# Altium schematic sheet 05 UFS.SchDoc: CM4 IO
size 297 x 209 mm; Page Create Date: March  8, 1995; Page Number: 5; Page Size: A4; Comment: radxa_1010; Page Count: 19; RevCode: V1.10; Doc: 05 UFS; DsnPath: D:\WMS\黄工\[RC126]CM4_IO_V1.10\[RC126]_V1.10\CM4 IO_V1.10.DSN; SchematicName: CM4 IO V1.10; PageName: 05 UFS; PageSize: A4; TopSchematic: True
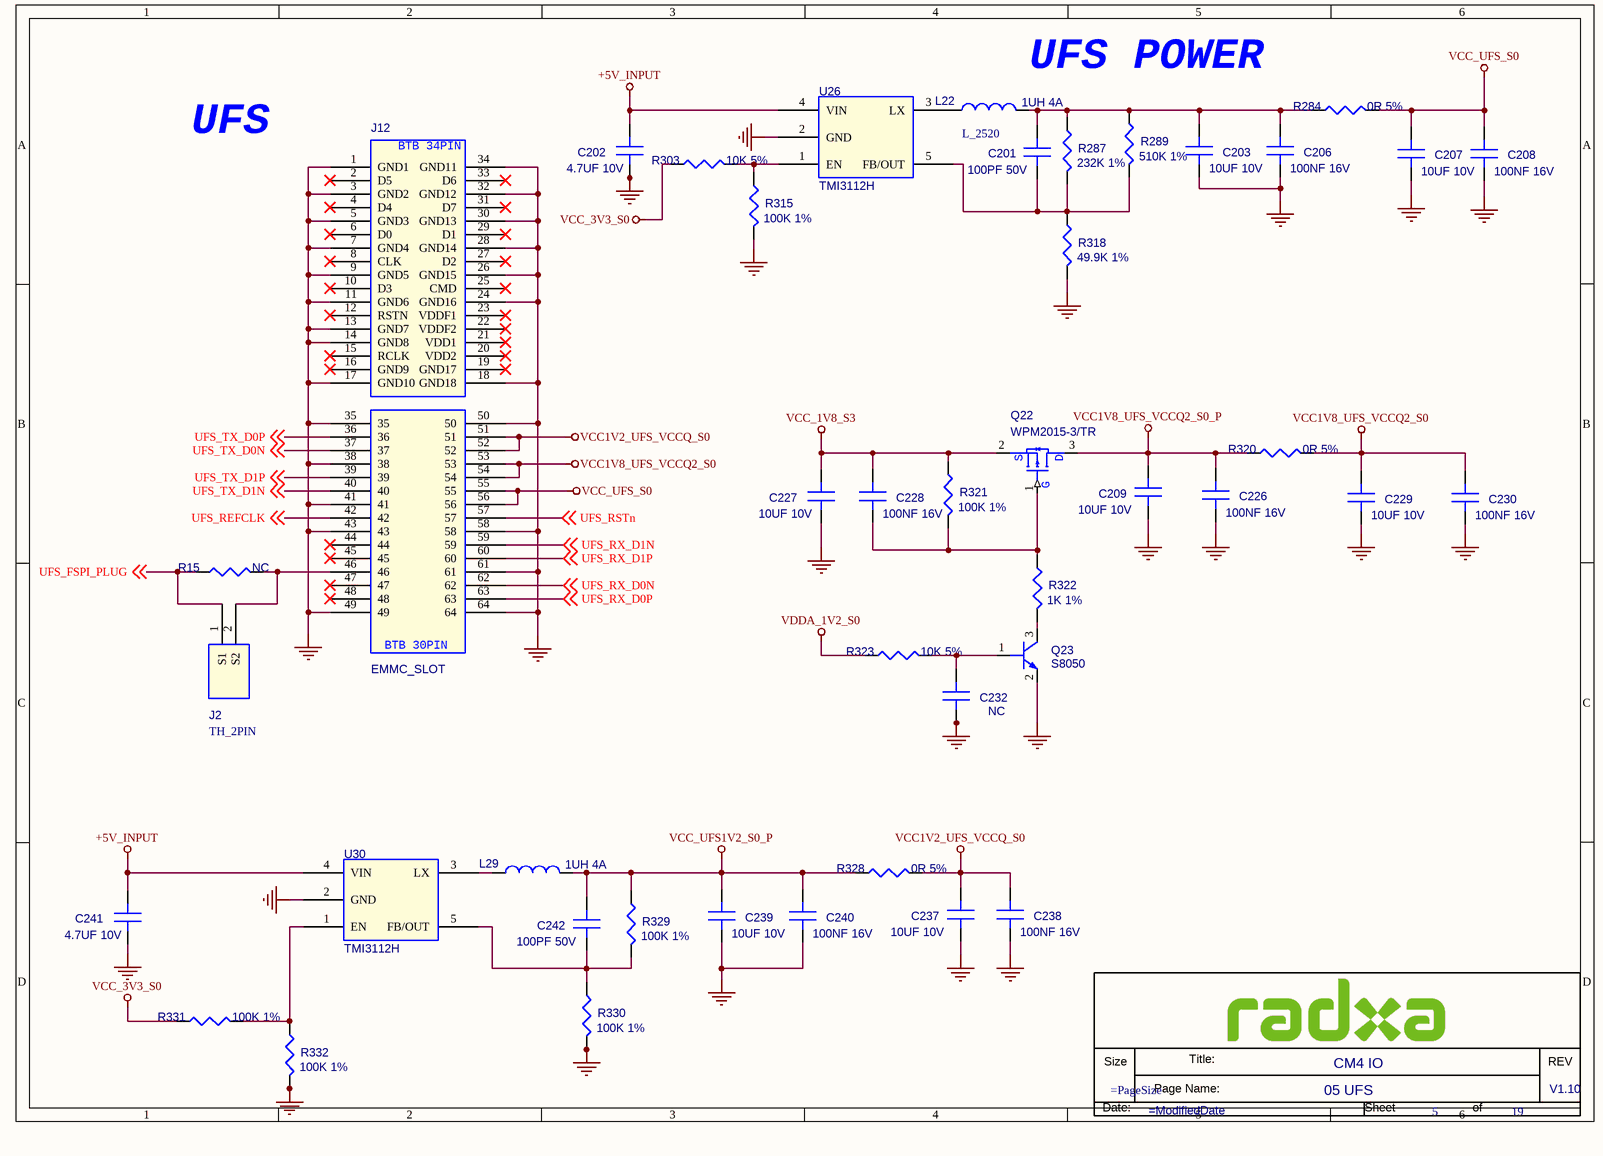
[diagram p0: 05 UFS.SchDoc]

## Parts
*  Doc: 05 UFS  RevCode: V1.10  Title: CM4 IO  Page Number: 5  Page Count: 19  (hidden comment: radxa_1010)  (graphical)
C201  100PF 50V  [C0201]
C202  4.7UF 10V  [C0402]
C203  10UF 10V  [C0402]
C206  100NF 16V  [C0201]
C207  10UF 10V  [C0402]
C208  100NF 16V  [C0201]
C209  10UF 10V  [C0402]
C226  100NF 16V  [C0201]
C227  10UF 10V  [C0402]
C228  100NF 16V  [C0201]
C229  10UF 10V  [C0402]
C230  100NF 16V  [C0201]
C232  NC  [C0201]
C237  10UF 10V  [C0402]
C238  100NF 16V  [C0201]
C239  10UF 10V  [C0402]
C240  100NF 16V  [C0201]
C241  4.7UF 10V  [C0402]
C242  100PF 50V  [C0201]
J2  TH_2PIN  [CON_TH1X2_2D54_STA]
J12  EMMC_SLOT  [EMMC_SLOT_30P_34P]
L22  1UH 4A  [L_2520]
L29  1UH 4A  [L_2520]
Q22  WPM2015-3/TR  [SOT_23]
Q23  S8050  [SOT_23]
R15  NC  [R0402]
R284  0R 5%  [R0402]
R287  232K 1%  [R0402]
R289  510K 1%  [R0402]
R303  10K 5%  [R0402]
R315  100K 1%  [R0402]
R318  49.9K 1%  [R0402]
R320  0R 5%  [R0402]
R321  100K 1%  [R0402]
R322  1K 1%  [R0402]
R323  10K 5%  [R0402]
R328  0R 5%  [R0402]
R329  100K 1%  [R0402]
R330  100K 1%  [R0402]
R331  100K 1%  [R0402]
R332  100K 1%  [R0402]
U26  TMI3112H  [SOT23_5]
U30  TMI3112H  [SOT23_5]

## Nets
+5V_INPUT: C202.1(A) C241.1(A) U26.4(VIN) U30.4(VIN)
GND: C202.2(B) C203.2(B) C206.2(B) C207.2(B) C208.2(B) C209.2(B) C226.2(B) C227.2(B) C229.2(B) C230.2(B) C232.2(B) C237.2(B) C238.2(B) C239.2(B) C240.2(B) C241.2(B) J12.1(GND1) J12.3(GND2) J12.5(GND3) J12.7(GND4) J12.9(GND5) J12.11(GND6) J12.13(GND7) J12.14(GND8) J12.17(GND10) J12.18(GND18) J12.24(GND16) J12.26(GND15) J12.28(GND14) J12.30(GND13) J12.32(GND12) J12.34(GND11) J12.35 J12.38 J12.41 J12.43 J12.49 J12.50 J12.58 J12.61 J12.64 Q23.2(EMITTER) R315.2 R318.2 R330.2 R332.2 U26.2(GND) U30.2(GND)
VCC1V2_UFS_VCCQ_S0: C237.1(A) C238.1(A) J12.51 J12.52 R328.2
VCC1V8_UFS_VCCQ2_S0: C229.1(A) C230.1(A) J12.53 J12.54 R320.2
VCC1V8_UFS_VCCQ2_S0_P: C209.1(A) C226.1(A) Q22.3(D) R320.1
VCC_1V8_S3: C227.1(A) C228.1(A) Q22.2(S) R321.1
VCC_3V3_S0: R303.1 R331.1
VCC_UFS1V2_S0_P: C239.1(A) C240.1(A) C242.1(A) L29.2 R328.1 R329.1
VCC_UFS_S0: C207.1(A) C208.1(A) J12.55 J12.56 R284.2
VDDA_1V2_S0: R323.1
UFS_FSPI_PLUG: J2.1(S1) R15.1 ; off-sheet UFS_FSPI_PLUG
UFS_REFCLK: J12.42 ; off-sheet UFS_REFCLK
UFS_RSTn: J12.57 ; off-sheet UFS_RSTn
UFS_RX_D0N: J12.62 ; off-sheet UFS_RX_D0N
UFS_RX_D0P: J12.63 ; off-sheet UFS_RX_D0P
UFS_RX_D1N: J12.59 ; off-sheet UFS_RX_D1N
UFS_RX_D1P: J12.60 ; off-sheet UFS_RX_D1P
UFS_TX_D0N: J12.37 ; off-sheet UFS_TX_D0N
UFS_TX_D0P: J12.36 ; off-sheet UFS_TX_D0P
UFS_TX_D1N: J12.40 ; off-sheet UFS_TX_D1N
UFS_TX_D1P: J12.39 ; off-sheet UFS_TX_D1P
NetC201_1: C201.1(A) C203.1(A) C206.1(A) L22.2 R284.1 R287.1 R289.1
NetC201_2: C201.2(B) R287.2 R289.2 R318.1 U26.5(FB/OUT)
NetC228_2: C228.2(B) Q22.1(G) R321.2 R322.1
NetC232_1: C232.1(A) Q23.1(BASE) R323.2
NetC242_2: C242.2(B) R329.2 R330.1 U30.5(FB/OUT)
NetJ2_2: J2.2(S2) J12.46 R15.2
NetL22_1: L22.1 U26.3(LX)
NetL29_1: L29.1 U30.3(LX)
NetQ23_3: Q23.3(COLLECTOR) R322.2
NetR303_2: R303.2 R315.1 U26.1(EN)
NetR331_2: R331.2 R332.1 U30.1(EN)

Not connected (* = marked no-connect by the designer): J12 2(D5)* 4(D4)* 6(D0)* 8(CLK)* 10(D3)* 12(RSTN)* 15(RCLK)* 16(GND9)* 19(GND17)* 20(VDD2)* 21(VDD1)* 22(VDDF2)* 23(VDDF1)* 25(CMD)* 27(D2)* 29(D1)* 31(D7)* 33(D6)* 44* 45* 47* 48*

## Notes on the sheet
- UFS POWER
- UFS
- (in symbol EMMC_SLOT) BTB 34PIN; BTB 30PIN
- (in symbol radxa_1010) Size; Title:; REV; Page Name:; Date:; Sheet; of

## Library data of the parts
C201 = C: SMD  0201  100PF  50V  X5R  ±5%  ROHS; PARTS: 1; Part Reference: C201; Part Number: A1C01.00070; OriginalSymbolOrigin: (0,30); PKG_TYPE: CAP2-100-250; LEVEL: STD; PINSWAP: (A,B); Value: 100PF 50V; Part Type: 陶瓷电容; PCB Footprint: C0201
C202 = C: SMD  0402  4.7UF  10V  X5R  ±20%  ROHS; PARTS: 1; Part Reference: C202; Part Number: A1C01.00073; OriginalSymbolOrigin: (0,30); PKG_TYPE: CAP2-100-250; LEVEL: STD; PINSWAP: (A,B); Value: 4.7UF 10V; Part Type: 陶瓷电容; PCB Footprint: C0402
C203 = C: SMD  0402  10UF  10V  X5R  ±20%  ROHS; PARTS: 1; Part Reference: C203; Part Number: A1C01.00025; OriginalSymbolOrigin: (0,30); PKG_TYPE: CAP2-100-250; LEVEL: STD; PINSWAP: (A,B); Value: 10UF 10V; PCB Footprint: C0402; Part Type: 陶瓷电容
C206 = C: SMD  0201  100NF  16V  X5R  ±20%  ROHS; PARTS: 1; Part Reference: C206; Part Number: A1C01.00099; OriginalSymbolOrigin: (0,30); PKG_TYPE: CAP2-100-250; LEVEL: STD; PINSWAP: (A,B); Preferred: 6715f349cd0bc5; Value: 100NF 16V; Part Type: 陶瓷电容
C207 = C: SMD  0402  10UF  10V  X5R  ±20%  ROHS; PARTS: 1; Part Reference: C207; Part Number: A1C01.00025; OriginalSymbolOrigin: (0,30); PKG_TYPE: CAP2-100-250; LEVEL: STD; PINSWAP: (A,B); Preferred: 6715f349cd0bc5; Value: 10UF 10V; Part Type: 陶瓷电容
C208 = C: SMD  0201  100NF  16V  X5R  ±20%  ROHS; PARTS: 1; Part Reference: C208; Part Number: A1C01.00099; OriginalSymbolOrigin: (0,30); PKG_TYPE: CAP2-100-250; LEVEL: STD; PINSWAP: (A,B); Preferred: 6715f349cd0bc5; Value: 100NF 16V; Part Type: 陶瓷电容
C209 = C: SMD  0402  10UF  10V  X5R  ±20%  ROHS; PARTS: 1; Part Reference: C209; Part Number: A1C01.00025; OriginalSymbolOrigin: (0,30); PKG_TYPE: CAP2-100-250; LEVEL: STD; PINSWAP: (A,B); Preferred: 6715f349cd0bc5; Value: 10UF 10V; Part Type: 陶瓷电容
C226 = C: SMD  0201  100NF  16V  X5R  ±20%  ROHS; PARTS: 1; Part Reference: C226; Part Number: A1C01.00099; OriginalSymbolOrigin: (0,30); PKG_TYPE: CAP2-100-250; LEVEL: STD; PINSWAP: (A,B); Preferred: 6715f349cd0bc5; Value: 100NF 16V; Part Type: 陶瓷电容
C227 = C: SMD  0402  10UF  10V  X5R  ±20%  ROHS; PARTS: 1; Part Reference: C227; Part Number: A1C01.00025; OriginalSymbolOrigin: (0,30); PKG_TYPE: CAP2-100-250; LEVEL: STD; PINSWAP: (A,B); Preferred: 6715f349cd0bc5; Value: 10UF 10V; Part Type: 陶瓷电容
C228 = C: SMD  0201  100NF  16V  X5R  ±20%  ROHS; PARTS: 1; Part Reference: C228; Part Number: A1C01.00099; OriginalSymbolOrigin: (0,30); PKG_TYPE: CAP2-100-250; LEVEL: STD; PINSWAP: (A,B); Preferred: 6715f349cd0bc5; Value: 100NF 16V; Part Type: 陶瓷电容
C229 = C: SMD  0402  10UF  10V  X5R  ±20%  ROHS; PARTS: 1; Part Reference: C229; Part Number: A1C01.00025; OriginalSymbolOrigin: (0,30); PKG_TYPE: CAP2-100-250; LEVEL: STD; PINSWAP: (A,B); Preferred: 6715f349cd0bc5; Value: 10UF 10V; Part Type: 陶瓷电容
C230 = C: SMD  0201  100NF  16V  X5R  ±20%  ROHS; PARTS: 1; Part Reference: C230; Part Number: A1C01.00099; OriginalSymbolOrigin: (0,30); PKG_TYPE: CAP2-100-250; LEVEL: STD; PINSWAP: (A,B); Preferred: 6715f349cd0bc5; Value: 100NF 16V; Part Type: 陶瓷电容
C232 = C: SMD  0201  100NF  10V  X5R  ±20%  ROHS; PARTS: 1; Part Reference: C232; Part Number: A1C01.00009; OriginalSymbolOrigin: (0,30); PKG_TYPE: CAP2-100-250; LEVEL: STD; PINSWAP: (A,B); Value: NC; PCB Footprint: C0201; Part Type: 陶瓷电容
C237 = C: SMD  0402  10UF  10V  X5R  ±20%  ROHS; PARTS: 1; Part Reference: C237; Part Number: A1C01.00025; OriginalSymbolOrigin: (0,30); PKG_TYPE: CAP2-100-250; LEVEL: STD; PINSWAP: (A,B); Preferred: 6715f349cd0bc5; Value: 10UF 10V; Part Type: 陶瓷电容
C238 = C: SMD  0201  100NF  16V  X5R  ±20%  ROHS; PARTS: 1; Part Reference: C238; Part Number: A1C01.00099; OriginalSymbolOrigin: (0,30); PKG_TYPE: CAP2-100-250; LEVEL: STD; PINSWAP: (A,B); Preferred: 6715f349cd0bc5; Value: 100NF 16V; Part Type: 陶瓷电容
C239 = C: SMD  0402  10UF  10V  X5R  ±20%  ROHS; PARTS: 1; Part Reference: C239; Part Number: A1C01.00025; OriginalSymbolOrigin: (0,30); PKG_TYPE: CAP2-100-250; LEVEL: STD; PINSWAP: (A,B); Preferred: 6715f349cd0bc5; Value: 10UF 10V; Part Type: 陶瓷电容
C240 = C: SMD  0201  100NF  16V  X5R  ±20%  ROHS; PARTS: 1; Part Reference: C240; Part Number: A1C01.00099; OriginalSymbolOrigin: (0,30); PKG_TYPE: CAP2-100-250; LEVEL: STD; PINSWAP: (A,B); Preferred: 6715f349cd0bc5; Value: 100NF 16V; Part Type: 陶瓷电容
C241 = C: SMD  0402  4.7UF  10V  X5R  ±20%  ROHS; PARTS: 1; Part Reference: C241; Part Number: A1C01.00073; OriginalSymbolOrigin: (0,30); PKG_TYPE: CAP2-100-250; LEVEL: STD; PINSWAP: (A,B); Value: 4.7UF 10V; PCB Footprint: C0402; Part Type: 陶瓷电容
C242 = C: SMD  0201  100PF  50V  X5R  ±5%  ROHS; PARTS: 1; Part Reference: C242; Part Number: A1C01.00070; OriginalSymbolOrigin: (0,30); PKG_TYPE: CAP2-100-250; LEVEL: STD; PINSWAP: (A,B); Value: 100PF 50V; PCB Footprint: C0201; Part Type: 陶瓷电容
J2 = TH_2PIN: DIP  排针座  1*2PIN  180度  2.54mm脚距  中间朔高2.5mm  针长一端6.1mm  另一端3.0mm  黑色  PH2.54 1*2P L=11.6/3.0  国意英  ROHS; Part Reference: J2; Part Number: A1J02.00011; Temp Coeff: -40°C to +105°C; Preferred: 6715f352cd0bcd; PCB Footprint: CON_TH1X2_2D54_STA_PZ; Value: TH_2PIN; Part Type: 排座
J12 = EMMC_SLOT: SMD  公座  2*17PIN  180度  8.3*2.7  0.4mm脚距  GB042-34P-H10-E3000  黑色  LG  ROHS; Part Reference: J12; Part Number: A1J01.00030; Value: EMMC_SLOT; Part Type: 连接座; PCB Footprint: EMMC_SLOT_30P_34P
L22 = L: SMD  带屏蔽  2.5x2x1.2mm  1UH  4A  ±20%  RHP252012T-1R0MT  仁芯微  ROHS; Part Reference: L22; Part Number: A1L01.00117; Preferred: 6715f349cd0bc5; Temp Coeff: -55℃ to +125℃; PCB Footprint: L_2520; Value: 1UH 4A; Part Type: 贴片功率电感
L29 = L: SMD  带屏蔽  2.5x2x1.2mm  1UH  4A  ±20%  RHP252012T-1R0MT  仁芯微  ROHS; Part Reference: L29; Part Number: A1L01.00117; Preferred: 6715f349cd0bc5; Temp Coeff: -55℃ to +125℃; Value: 1UH 4A; Part Type: 贴片功率电感
Q22 = MOSFET_PNP: SMD编带  SOT-23  WPM2015-3/TR  P沟道  ROHS; Part Reference: Q22; Part Number: A1D01.00019; Temp Coeff: -55℃ to ＋150℃; Value: WPM2015-3/TR; PCB Footprint: SOT_23; Part Type: 三极管-MOS管
Q23 = NPN: SMD编带  SOT-23  S8050  NPN  ROHS; Part Reference: Q23; Manufacturer PN: S8050_SOT23; Manufacturer: 长电; Part Number: A1D01.00009; Pc: 0.3W; Vceo: 25V; Ic: 0.5A; Priority: A; Temp Coeff: -55℃ to ＋150℃; PCB Footprint: SOT_23; Value: S8050; Created by: JJJ; Part Type: 三极管-MOS管; RK PN: S8050
R15 = R: SMD  0201  0R  1/20W  ±5%  ROHS; Part Reference: R15; Part Number: A1R01.00027; PCB Footprint: R0201; Temp Coeff: －55℃ ~ ＋125℃; Value: NC; Part Type: 贴片电阻
R284 = R: SMD  0201  0R  1/20W  ±5%  ROHS; Part Reference: R284; Part Number: A1R01.00027; PCB Footprint: R0201; Temp Coeff: －55℃ ~ ＋125℃; Value: 0R 5%; Part Type: 贴片电阻
R287 = R: SMD  0201  232K  1/20W  ±1%  ROHS; Part Reference: R287; Part Number: A1R01.00189; PCB Footprint: R0201; Value: 232K 1%; Part Type: 贴片电阻
R289 = R: SMD  0201  510K  1/20W  ±1%  ROHS; Part Reference: R289; Part Number: A1R01.00460; PCB Footprint: R0201; Value: 510K 1%; Part Type: 贴片电阻
R303 = R: SMD  0201  10K  1/20W  ±5%  ROHS; Part Reference: R303; Part Number: A1R01.00012; PCB Footprint: R0201; Temp Coeff: －55℃ ~ ＋125℃; Value: 10K 5%; Part Type: 贴片电阻
R315 = R: SMD  0201  100K  1/20W  ±1%  ROHS; Part Reference: R315; Part Number: A1R01.00165; PCB Footprint: R0201; Value: 100K 1%; Part Type: 贴片电阻
R318 = R: SMD  0201  49.9K  1/20W  ±1%  ROHS; Part Reference: R318; Part Number: A1R01.00207; PCB Footprint: R0201; Value: 49.9K 1%; Part Type: 贴片电阻
R320 = R: SMD  0201  0R  1/20W  ±5%  ROHS; Part Reference: R320; Part Number: A1R01.00027; PCB Footprint: R0201; Temp Coeff: －55℃ ~ ＋125℃; Value: 0R 5%; Part Type: 贴片电阻
R321 = R: SMD  0201  100K  1/20W  ±1%  ROHS; Part Reference: R321; Part Number: A1R01.00165; PCB Footprint: R0201; Value: 100K 1%; Part Type: 贴片电阻
R322 = R: SMD  0201  1K  1/20W  ±1%  ROHS; Part Reference: R322; Part Number: A1R01.00111; PCB Footprint: R0201; Value: 1K 1%; Part Type: 贴片电阻
R323 = R: SMD  0201  10K  1/20W  ±5%  ROHS; Part Reference: R323; Part Number: A1R01.00012; PCB Footprint: R0201; Temp Coeff: －55℃ ~ ＋125℃; Value: 10K 5%; Part Type: 贴片电阻
R328 = R: SMD  0201  0R  1/20W  ±5%  ROHS; Part Reference: R328; Part Number: A1R01.00027; PCB Footprint: R0201; Temp Coeff: －55℃ ~ ＋125℃; Value: 0R 5%; Part Type: 贴片电阻
R329 = R: SMD  0201  100K  1/20W  ±1%  ROHS; Part Reference: R329; Part Number: A1R01.00165; PCB Footprint: R0201; Value: 100K 1%; Part Type: 贴片电阻
R330 = R: SMD  0201  100K  1/20W  ±1%  ROHS; Part Reference: R330; Part Number: A1R01.00165; PCB Footprint: R0201; Value: 100K 1%; Part Type: 贴片电阻
R331 = R: SMD  0201  100K  1/20W  ±1%  ROHS; Part Reference: R331; Part Number: A1R01.00165; PCB Footprint: R0201; Value: 100K 1%; Part Type: 贴片电阻
R332 = R: SMD  0201  100K  1/20W  ±1%  ROHS; Part Reference: R332; Part Number: A1R01.00165; PCB Footprint: R0201; Value: 100K 1%; Part Type: 贴片电阻
U26 = DCDC_ETA3409: SMD  降压转换器  TMI3112H  SOT-23-5  TMI  ROHS; Part Reference: U26; Part Number: A1I01.00618; Manufacturer: TMI(拓尔微电子); Option: /TCS4203; RK PN: 906,000,416; Priority: A; PCB Footprint: SOT23_5; Value: TMI3112H; Part Type: 集成电路/模块; Manufacturer PN: TMI3112H; Created by: JJJ
U30 = DCDC_ETA3409: SMD  降压转换器  TMI3112H  SOT-23-5  TMI  ROHS; Part Reference: U30; Manufacturer: TMI(拓尔微电子); Part Number: A1I01.00618; Option: /TCS4203; RK PN: 906,000,416; Priority: A; PCB Footprint: SOT23_5; Value: TMI3112H; Part Type: 集成电路/模块; Manufacturer PN: TMI3112H; Created by: JJJ
* = radxa_1010: Page Create Date: March  8, 1995; Page Size: =PageSize; Page Modify Date: =ModifiedDate